# EAGLE design lightmagic (EAGLE 7.7.0)
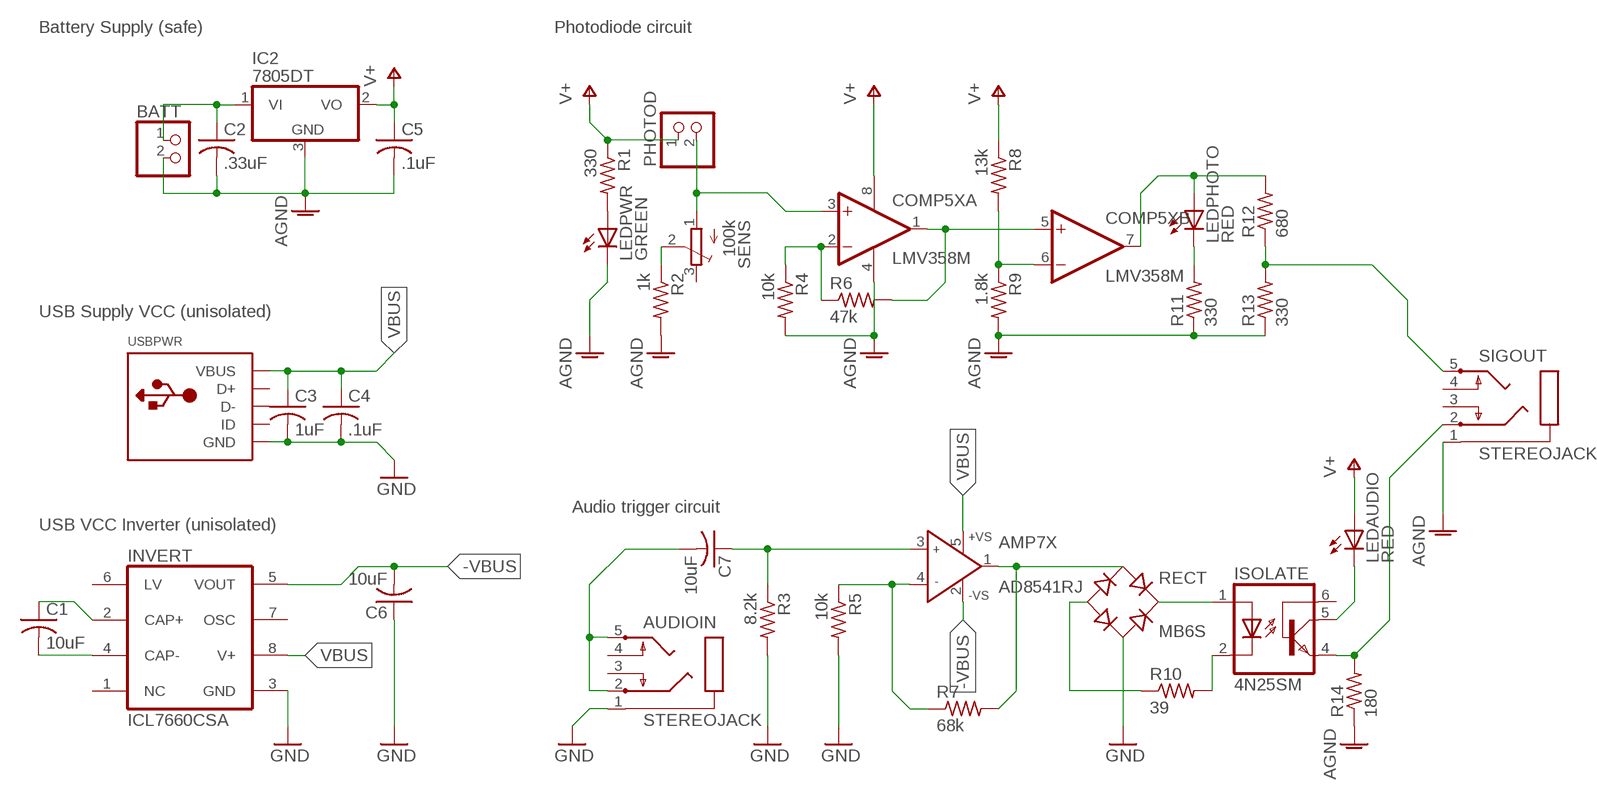
[diagram p0: schematic, sheet 1]

## Parts
AMP7X  AD8541RJ  [SOT23-5]
AUDIOIN  STEREOJACK  [STX3100]
BATT  PINHD-1X2  [1X02]
C1  10uF  C-USC0805  [C0805]
C2  .33uF  C-USC0805  [C0805]
C3  1uF  C-USC0805  [C0805]
C4  .1uF  C-USC0805  [C0805]
C5  .1uF  C-USC0805  [C0805]
C6  10uF  C-USC0805  [C0805]
C7  10uF  C-USC0805  [C0805]
COMP5X  LMV358M  [SO08]
IC2  7805DT  [TO252]
INVERT  ICL7660CSA  [SO08]
ISOLATE  4N25SM  [DIL6-SMD]
LEDAUDIO  RED  LEDCHIP-LED0805  [CHIP-LED0805]
LEDPHOTO  RED  LEDCHIP-LED0805  [CHIP-LED0805]
LEDPWR  GREEN  LEDCHIP-LED0805  [CHIP-LED0805]
PHOTOD  PINHD-1X2  [1X02]
R1  330  R-US_R0805  [R0805]
R2  1k  R-US_R0805  [R0805]
R3  8.2k  R-US_R0805  [R0805]
R4  10k  R-US_R0805  [R0805]
R5  10k  R-US_R0805  [R0805]
R6  47k  R-US_R0805  [R0805]
R7  68k  R-US_R0805  [R0805]
R8  13k  R-US_R0805  [R0805]
R9  1.8k  R-US_R0805  [R0805]
R10  39  R-US_R0805  [R0805]
R11  330  R-US_R0805  [R0805]
R12  680  R-US_R0805  [R0805]
R13  330  R-US_R0805  [R0805]
R14  180  R-US_R0805  [R0805]
RECT  MB6S  [SOIC-4]
SENS  100k  TRIMPOTTC33X  [TC33X]
SIGOUT  STEREOJACK  [STX3100]
USBPWR  USBMINIB  [USB-MINIB]

## Nets
-VBUS: AMP7X.2(-VS) C6.2 INVERT.5(VOUT)
AGND: BATT.2 C2.2 C5.2 COMP5X.4(P:V-) IC2.3(GND) LEDPWR.C R2.2 R4.2 R9.2 R11.1 R13.1 R14.1 SIGOUT.1
GND: AUDIOIN.1 C3.2 C4.2 C6.1 INVERT.3(GND) R3.2 R5.2 RECT.~2(AC2) USBPWR.GND
N$1: AMP7X.4(IN-) R5.1 R7.1
N$2: C1.1 INVERT.2(CAP+)
N$3: C1.2 INVERT.4(CAP-)
N$4: AUDIOIN.2 AUDIOIN.5 C7.2
N$5: AMP7X.3(IN+) C7.1 R3.1
N$6: AMP7X.1(OUT) R7.2 RECT.~1(AC1)
N$7: ISOLATE.1(A) RECT.+
N$8: ISOLATE.2(C) R10.2
N$9: R10.1 RECT.-
N$10: BATT.1 C2.1 IC2.1(VI)
N$11: R2.1 SENS.2(S)
N$12: LEDPWR.A R1.2
N$13: COMP5X.3(A:+IN) PHOTOD.2 SENS.1(A)
N$14: COMP5X.2(A:-IN) R4.1 R6.1
N$15: COMP5X.1(A:OUT) COMP5X.5(B:+IN) R6.2
N$16: COMP5X.6(B:-IN) R8.2 R9.1
N$17: ISOLATE.4(EMI) R14.2 SIGOUT.2
N$18: ISOLATE.5(COL) LEDAUDIO.C
N$19: LEDPHOTO.C R11.2
N$20: R12.1 R13.2 SIGOUT.5
N$21: COMP5X.7(B:OUT) LEDPHOTO.A R12.2
V+: C5.1 COMP5X.8(P:V+) IC2.2(VO) LEDAUDIO.A PHOTOD.1 R1.1 R8.1
VBUS: AMP7X.5(+VS) C3.1 C4.1 INVERT.8(V+) USBPWR.VBUS
Unconnected: AUDIOIN.3 AUDIOIN.4 INVERT.1(NC) INVERT.6(LV) INVERT.7(OSC) ISOLATE.6(BAS) SENS.3(E) SIGOUT.3 SIGOUT.4 USBPWR.D+ USBPWR.D- USBPWR.ID

## Notes on the sheet
- Battery Supply (safe) | Photodiode circuit
- USB Supply VCC (unisolated)
- Audio trigger circuit
- USB VCC Inverter (unisolated)

## Library data of the parts
AMP7X = analog-devices:AD8541: General-Purpose CMOS Rail-to-Rail Amplifiers Source: http://www.analog.com/static/imported-files/data_sheets/AD8541_8542_8544.pdf; MPN: AD8541ARTZ-R2; OC_FARNELL: 1464963; OC_NEWARK: 28X4209
AUDIOIN SIGOUT = adafruit:STEREOJACK: MIC/HEADPHONE JACK Stereo jack with two switches. Kycon STX3100, CUI SJ1-3555NG and/or 4UCon 05544; MF: SWITCHCRAFT; MPN: 35RAPC4BHN2; OC_NEWARK: 96F9607
BATT PHOTOD = pinhead:PINHD-1X2: PIN HEADER; MF: TYCO ELECTRONICS; MPN: 640456-2; OC_NEWARK: 90F4250
C1 C6 C7 = adafruit:C-US: CAPACITOR, American symbol; MPN: GRT21BR61E106KE13L; OC_NEWARK: 01AC8983
C2 = adafruit:C-US: CAPACITOR, American symbol; MPN: MC0805B334K500CT; OC_NEWARK: 06X6218
C3 = adafruit:C-US: CAPACITOR, American symbol; MPN: C0805X104K3RAC3316; OC_NEWARK: 01AC1593
C4 C5 = adafruit:C-US: CAPACITOR, American symbol; MPN: 0805YC104KAT2A; OC_NEWARK: 05AC9650
COMP5X = linear:LMV358?*: Dual General Purpose, Low Voltage, Rail-to-Rail Output Operational Amplifiers Source: http://www.national.com/mpf/LM/LMV321.html http://www.national.com/dt/lmv_qual.pdf; MPN: LMV358M; OC_NEWARK: 97K3153
IC2 = linear:78*: Positive VOLTAGE REGULATOR Source: http://cache.national.com/ds/LM/LM78L05.pdf http://www.fairchildsemi.com/ds/LM/LM7805.pdf; MF: ON SEMICONDUCTOR; MPN: MC7805CDTG; OC_NEWARK: 71J5739
INVERT = maxim:ICL7660CSA: VOLTAGE CONVERTER; MF: NATIONAL SEMICONDUCTOR; MPN: LMC7660IM/NOPB; OC_FARNELL: 9724710; OC_NEWARK: 41K2738
ISOLATE = optocoupler:4N*?M: General Purpose 6-Pin Phototransistor Optocouplers Source: http://www.fairchildsemi.com/ds/4N/4N35-M.pdf; MPN: 4N25-300E; OC_FARNELL: 1021152; OC_NEWARK: 13M5766
LEDAUDIO LEDPHOTO LEDPWR = adafruit:LED: LED OSRAM: - CHIPLED LG R971, LG N971, LY N971, LG Q971, LY Q971, LO R971, LY R971 LH N974, LH R974 LS Q976, LO Q976, LY Q976 LO Q996 - Hyper CHIPLED LW Q18S LB Q993, LB Q99A, LB R99A - SideLED LS A670, LO A670, LY A670, LG A670, LP A670 LB A673, LV A673, LT A673, LW A673 LH A674 LY A675 LS A676, LA A676, LO A676, LY A676, LW A676 LS A679, LY A679, LG A679 - Hyper Micro SIDELED® LS Y876, LA Y876, LO Y876, LY Y876 LT Y87S - SmartLED LW L88C, LW L88S LB L89C, LB L89S, LG L890 LS L89K, LO L89K, LY L89K LS L896, LA L896, LO L896, LY L896 - TOPLED LS T670, LO T670, LY T670, LG T670, LP T670 LSG T670, LSP T670, LSY T670, LOP T670, LYG T670 LG T671, LOG T671, LSG T671 LB T673, LV T673, LT T673, LW T673 LH T674 LS T676, LA T676, LO T676, LY T676, LB T676, LH T676, LSB T676, LW T676 LB T67C, LV T67C, LT T67C, LS T67K, LO T67K, LY T67K, LW E67C LS E67B, LA E67B, LO E67B, LY E67B, LB E67C, LV E67C, LT E67C LW T67C LS T679, LY T679, LG T679 LS T770, LO T770, LY T770, LG T770, LP T770 LB T773, LV T773, LT T773, LW T773 LH T774 LS E675, LA E675, LY E675, LS T675 LS T776, LA T776, LO T776, LY T776, LB T776 LHGB T686 LT T68C, LB T68C - Hyper Mini TOPLED® LB M676 - Mini TOPLED Santana® LG M470 LS M47K, LO M47K, LY M47K Source: http://www.osram.convergy.de/; MPN: QTLP630C7TR; OC_NEWARK: 01AC7976
R1 R11 R13 = adafruit:R-US_: RESISTOR, American symbol; MPN: ERJ-6ENF3300V; OC_NEWARK: 90W3413
R2 = adafruit:R-US_: RESISTOR, American symbol; MPN: ERJ-6ENF12R0V; OC_NEWARK: 64R5373
R3 = adafruit:R-US_: RESISTOR, American symbol; MF: Multicomp Passives; MPN: MC01W080518K2; OC_NEWARK: 58K4911
R4 R5 = adafruit:R-US_: RESISTOR, American symbol; MF: VISHAY/DALE; MPN: CRCW080510K0FKTA; OC_NEWARK: 05F1511
R6 = adafruit:R-US_: RESISTOR, American symbol; MF: VISHAY/DALE; MPN: CRCW080547K0FKEA; OC_NEWARK: 42K4553
R7 = adafruit:R-US_: RESISTOR, American symbol; MF: VISHAY/DALE; MPN: CRCW080568K0FKEA; OC_NEWARK: 53K0428
R8 = adafruit:R-US_: RESISTOR, American symbol; MF: VISHAY/DALE; MPN: CRCW080513K0FKEA; OC_NEWARK: 42K4278
R9 = adafruit:R-US_: RESISTOR, American symbol; MF: VISHAY/DALE; MPN: CRCW08051K80FKEA; OC_NEWARK: 42K4228
R10 = adafruit:R-US_: RESISTOR, American symbol; MPN: ERJ-6GEYJ390V; OC_NEWARK: 53W4957
R12 = adafruit:R-US_: RESISTOR, American symbol; MPN: ERA-6AEB681V; OC_NEWARK: 08N2184
R14 = adafruit:R-US_: RESISTOR, American symbol; MF: VISHAY/DALE; MPN: CRCW0805180RJNEA; OC_NEWARK: 01H7775
RECT = rectifier:MB*S: Bridge Rectifier Source: http://www.fairchildsemi.com/ds/MB/MB6S.pdf; MF: FAIRCHILD SEMICONDUCTOR; MPN: MB6S; OC_NEWARK: 58K1814
SENS = adafruit:TRIMPOT: SMT trimmer potentiometer part number TC33X http://www.ladyada.net/library/eagle; MPN: CRCW0805100KJNEA; OC_NEWARK: 04M8142
USBPWR = adafruit:USB: USB Connectors USBMINIB - Surface Mount Female Mini-B USB Connector 4UConnector: 06564 By microbuilder.eu Thru-hole RA Female Mini-B USB Connector 4UConnector: 18732 By ladyada.net; MPN: 1734035-1; OC_NEWARK: 16M2760

## Board
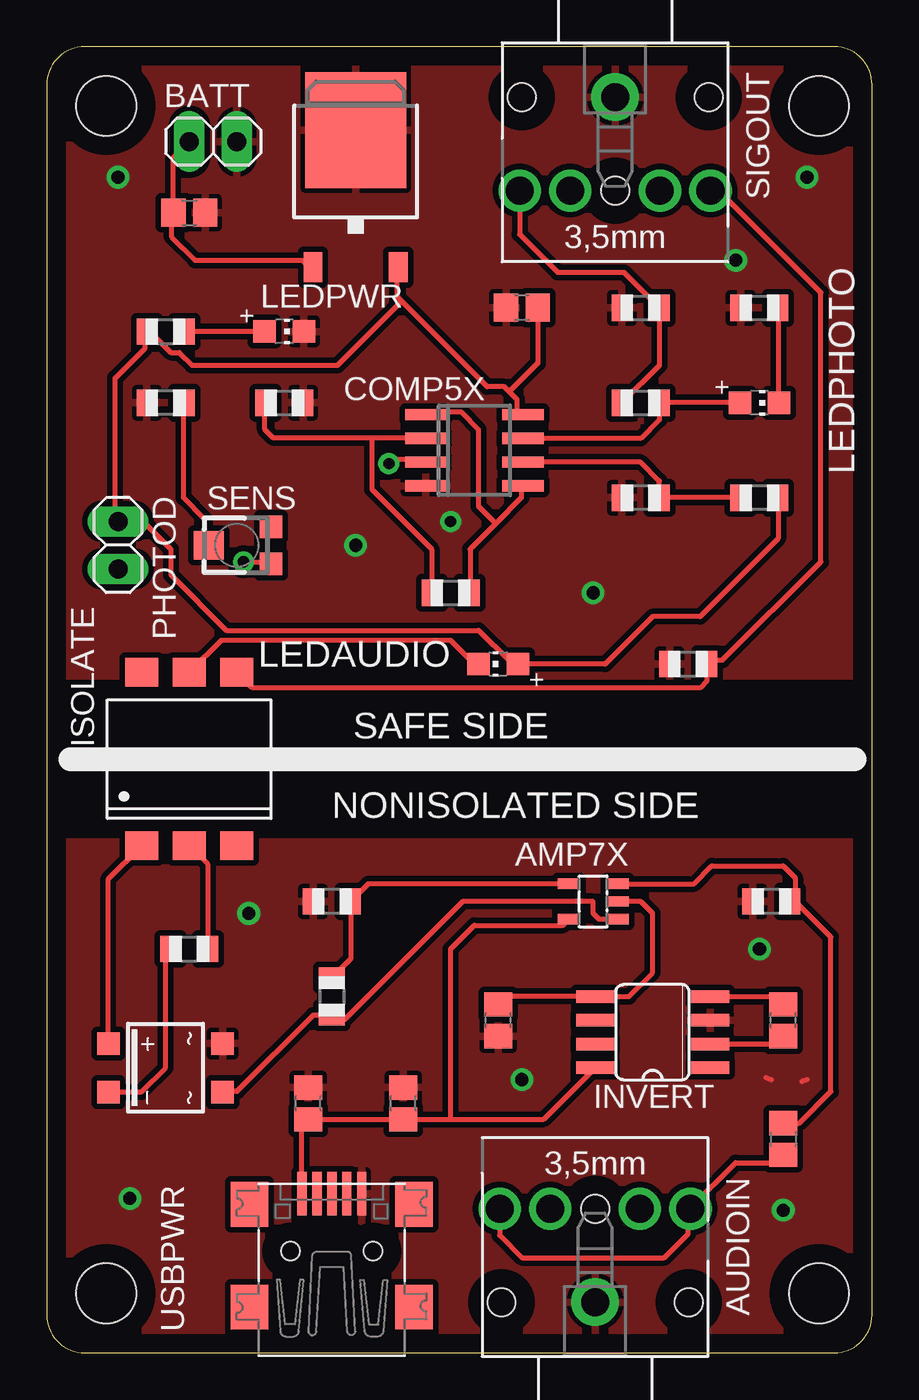
[diagram p1: board, top side]
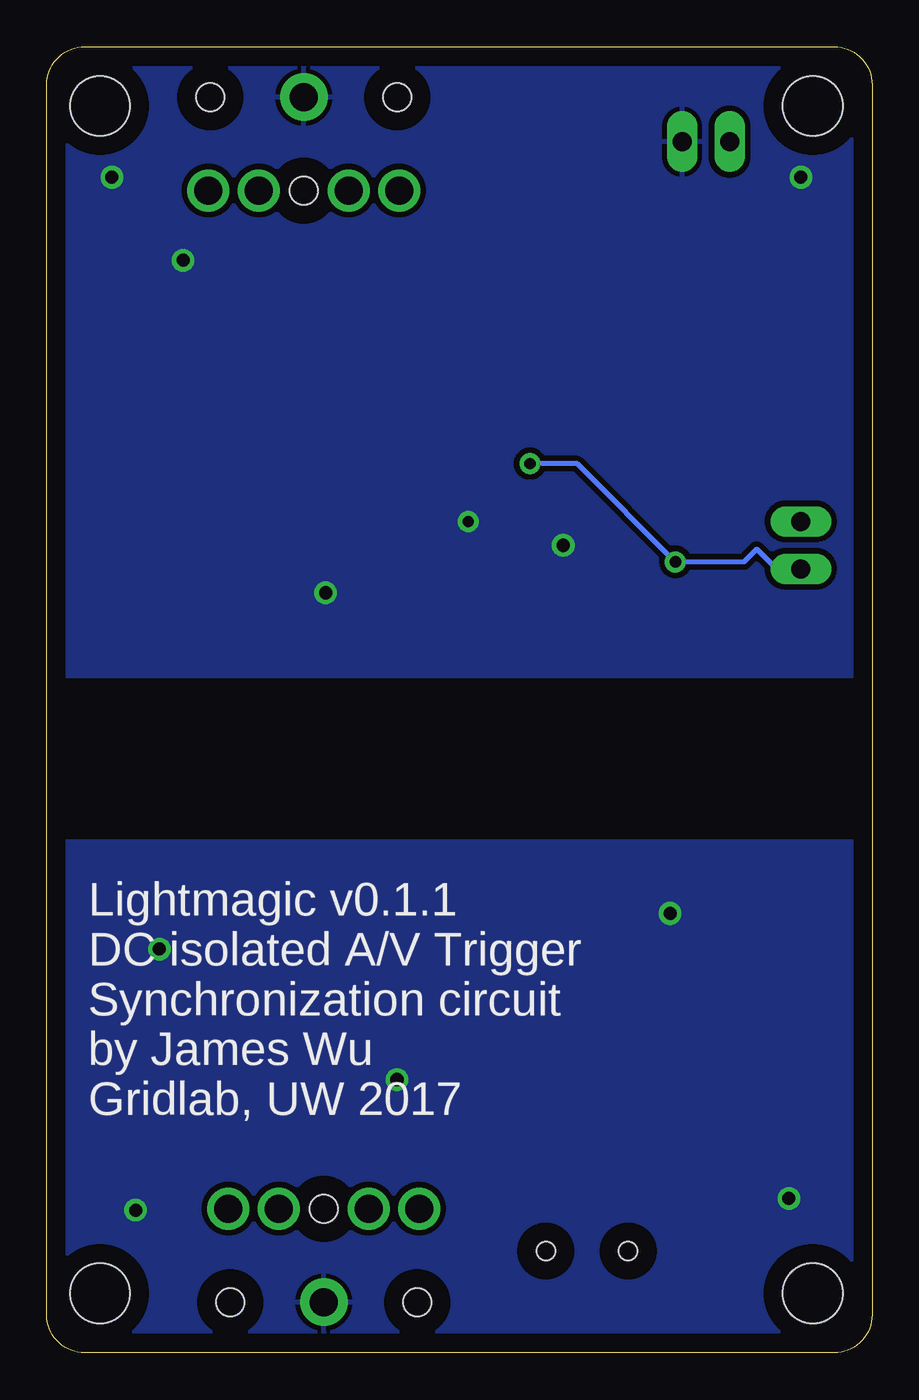
[diagram p2: board, bottom side, seen from below]

Size 44.12 x 69.84 mm. Coordinates in mm from the lower left corner, seen from the top.
Outline: 0,67.81 0,2.03 arc90 2.03,0 42.09,0 arc90 44.12,2.03 44.12,67.81 arc90 42.09,69.84 2.03,69.84 arc90 0,67.81
Copper layers (1*16): Top 0.035mm / dielectric 1.5mm / Bottom 0.035mm
Design rules "default *": minimum track width 10mil, minimum drill 24mil, track to track 8mil, track to pad 8mil, pad to pad 8mil, via to via 8mil, smd to smd 8mil, copper to edge 40mil, drill to drill 8mil, minimum pad ring 12mil, minimum via ring 10mil, stop-mask expansion 4mil, vias tented up to drill 0mil, thermal gap 10mil
Holes 3.2 mm at 41.27,3.17 3.17,3.17 3.17,66.67 41.27,66.67

### Footprints (pad centres in the part's own frame; a part is rotated, then mirrored left to right if it is on the bottom)
SOT23-5 = smd 0.55 x 1.2: 1 -0.95,-1.3; 2 0,-1.3; 3 0.95,-1.3; 4 0.95,1.3; 5 -0.95,1.3
STX3100 = drill 1.5 pad 2.54: 1 2.7,-0.1 | drill 1.5: 2 7.7,5; 3 7.7,2.3; 4 7.7,-2.5; 5 7.7,-5.2 | hole 1.5: 2.7,4.9; 2.7,-5.1; 7.7,-0.1
1X02 = drill 1.016 long: 1 -1.27,0; 2 1.27,0
C0805 = smd 1.3 x 1.5: 1 -0.85,0; 2 0.85,0
SO08 = smd 0.6 x 2.2: 1 -1.905,-2.6; 2 -0.635,-2.6; 3 0.635,-2.6; 4 1.905,-2.6; 5 1.905,2.6; 6 0.635,2.6; 7 -0.635,2.6; 8 -1.905,2.6
TO252 = smd 1 x 1.6: 1 -2.28,-4.8; 2 2.28,-4.8 | smd 5.4 x 6.2: 3 0,2.5
SO08' = smd 0.66 x 2.032: 1 -1.905,-3.073; 2 -0.635,-3.073; 3 0.635,-3.073; 4 1.905,-3.073; 5 1.905,3.073; 6 0.635,3.073; 7 -0.635,3.073; 8 -1.905,3.073
DIL6-SMD = smd 1.78 x 1.52: 1 -2.54,-4.645; 2 0,-4.645; 3 2.54,-4.645; 4 2.54,4.645; 5 0,4.645; 6 -2.54,4.645
CHIP-LED0805 = smd 1.2 x 1.2: A 0,-1.05; C 0,1.05
R0805 = smd 1.1 x 1.4: 1 -1,0; 2 1,0
SOIC-4 = smd 1.2 x 1.2: + 1.3,3.05; - -1.3,3.05; ~1 -1.3,-3.05; ~2 1.3,-3.05
TC33X = smd 1.2 x 1.2: 1 -1,-1.825; 3 1,-1.825 | smd 1.5 x 1.6: 2 0,1.5
USB-MINIB = smd 0.5 x 2.308: D+ 0,4.064; D- -0.8,4.064; GND 1.6,4.064; ID 0.8,4.064; VBUS -1.6,4.064 | smd 2 x 2.4: GND1 -4.4,-2; GND2 -4.4,3.5; GND3 4.4,3.5; GND4 4.4,-2 | hole 1: -2.2,1; 2.2,1

### Placement (x,y rotation side)
AMP7X  29.21,24.13 90 top
AUDIOIN  29.21,0 90 top
BATT  8.89,64.77 0 top
C1  39.37,17.78 90 top
C2  7.62,60.96 0 top
C3  19.05,13.34 90 top
C4  13.97,13.34 90 top
C5  25.4,55.88 180 top
C6  24.13,17.78 90 top
C7  39.37,11.43 270 top
COMP5X  22.86,48.26 270 top
IC2  16.51,62.87 0 top
INVERT  ICL7660CSA  [SO08']  32.38,17.14 90 top
ISOLATE  7.62,31.75 0 top
LEDAUDIO  24.13,36.83 90 top
LEDPHOTO  38.1,50.8 270 top
LEDPWR  12.7,54.61 270 top
PHOTOD  3.81,43.18 270 top
R1  6.35,54.61 0 top
R2  6.35,50.8 180 top
R3  38.73,24.13 180 top
R4  12.7,50.8 0 top
R5  15.24,24.13 180 top
R6  21.59,40.64 0 top
R7  15.24,19.05 270 top
R8  38.1,45.72 180 top
R9  31.75,45.72 180 top
R10  7.62,21.59 0 top
R11  38.1,55.88 0 top
R12  31.75,50.8 0 top
R13  31.75,55.88 0 top
R14  34.29,36.83 0 top
RECT  6.35,15.24 90 top
SENS  10.16,43.18 90 top
SIGOUT  30.48,69.85 270 top
USBPWR  15.24,4.45 0 top

### Tracks (layer width: path | path; a pad name or v marks a point on that pad's centre or on a via)
-VBUS
  Top 0.254: C6.2 24.55,19.05 INVERT.5 31.11,19.05 32.38,20.32 32.38,23.5 31.75,24.13 AMP7X.2
AGND  (via drill 0.61, 0.7)
  other vias: 40.64,62.87 3.81,62.87 36.83,58.42 21.59,44.45 16.51,43.18 29.21,40.64
  pour Top (isolate 0.305): -1.27,71.12 45.72,71.12 45.72,36.2 -1.27,36.2
  pour Bottom (isolate 0.305): 0,69.85 0,36.2 44.45,36.2 44.45,69.85
GND  (via drill 0.7)
  Top 0.254: 40.64,14.61 40.38,14.5 | 38.73,14.61 38.46,14.7
  other vias: 10.79,23.5 4.45,8.26 25.4,14.61 38.1,21.59 39.37,7.62
  pour Top (isolate 0.305): -1.27,27.3 45.72,27.3 45.72,0 -1.27,0
  pour Bottom (isolate 0.305): -1.27,27.3 45.72,27.3 45.72,-1.27 -1.27,-1.27
N$1
  Top 0.254: AMP7X.4 17.19,25.08 R5.1 16.24,21.05 R7.1
N$2
  Top 0.254: INVERT.2 38.95,16.51 C1.1
N$3
  Top 0.254: INVERT.4 38.95,19.05 C1.2
N$4
  Top 0.254: AUDIOIN.2 24.21,6.27 25.4,5.08 33.02,5.08 34.29,6.35 34.29,7.58 AUDIOIN.5 34.41,7.74 36.83,10.16 38.95,10.16 C7.2
N$5
  Top 0.254: C7.1 40.22,12.28 41.91,13.97 41.91,22.23 40.01,24.13 R3.1 40.01,24.4 40.01,25.4 39.37,26.04 35.56,26.04 34.6,25.08 AMP7X.3
N$6
  Top 0.254: AMP7X.1 29.52,23.18 29.21,23.5 29.21,24.13 22.23,24.13 15.88,17.78 15.51,17.78 R7.2 14.24,18.05 10.16,13.97 9.43,13.97 RECT.~1
N$7
  Top 0.254: RECT.+ 3.3,25.32 ISOLATE.1
N$8
  Top 0.254: R10.2 8.62,26.11 ISOLATE.2
N$9
  Top 0.254: RECT.- 5.05,13.94 6.35,15.24 6.35,21.32 R10.1
N$10
  Top 0.254: BATT.1 6.77,63.92 C2.1 6.67,60.96 6.67,59.69 7.94,58.42 13.65,58.42 13.97,58.1 IC2.1
N$11
  Top 0.254: R2.1 7.32,50.75 7.32,45.72 8.46,44.58 8.46,43.2 SENS.2
N$12
  Top 0.254: LEDPWR.A 11.43,54.63 7.54,54.63 R1.2
N$13  (via drill 0.61)
  Top 0.254: v10.52,42.29 11.89,42.29 SENS.1 | v18.29,47.55 18.52,47.55 18.75,47.78 20.12,47.78 COMP5X.3
  Bottom 0.254: PHOTOD.2 3.89,42.06 5.26,42.06 6.17,42.98 6.86,42.29 v10.52,42.29 15.77,47.55 v18.29,47.55
N$14
  Top 0.254: 17.37,48.92 20.12,48.92 COMP5X.2 | 17.37,48.92 12.12,48.92 11.66,49.38 11.66,50.75 R4.1 | 17.37,48.92 17.37,46.18 20.57,42.98 20.57,40.69 R6.1
N$15
  Top 0.254: 24,44.35 25.38,45.72 25.38,46.18 COMP5X.5 | 24,44.35 22.63,42.98 22.63,40.69 R6.2 | 24,44.35 23.09,45.26 23.09,49.38 22.17,50.29 20.34,50.29 COMP5X.1
N$16
  Top 0.254: R8.2 R9.1 32.75,46.62 31.75,47.62 COMP5X.6
N$17
  Top 0.254: SIGOUT.2 35.66,61.95 36.12,61.95 41.38,56.69 41.38,42.29 36.12,37.03 35.43,37.03 R14.2 35.29,35.92 34.92,35.56 10.99,35.56 ISOLATE.4
N$18
  Top 0.254: LEDAUDIO.C 22.86,36.83 21.59,38.1 9.32,38.1 ISOLATE.5
N$19
  Top 0.254: LEDPHOTO.C 39.09,50.98 39.09,55.78 R11.2
N$20
  Top 0.254: SIGOUT.5 25.28,59.81 27.3,57.78 30.84,57.78 R13.2 32.75,52.8 R12.1
N$21
  Top 0.254: LEDPHOTO.A R12.2 32.75,49.9 31.75,48.9 COMP5X.7
V+
  Top 0.254: 18.97,56.24 23.55,51.66 24.46,51.66 24.73,51.4 | 18.97,56.24 18.75,56.46 18.75,58.06 IC2.2 | 24.73,51.4 25.15,50.98 25.15,50.29 25.38,50.06 COMP5X.8 | 18.97,56.24 15.54,52.81 7.77,52.81 7.09,53.49 6.63,53.49 5.49,54.63 R1.1 5.26,54.41 5.26,53.72 3.66,52.12 3.66,44.58 PHOTOD.1 3.89,44.35 5.26,44.35 6.63,42.98 6.63,41.6 9.6,38.63 23.09,38.63 24.69,37.03 25.15,37.03 LEDAUDIO.A 29.84,36.83 32.38,39.37 34.92,39.37 39.1,43.55 R8.1 | C5.1 26.25,52.92 24.73,51.4
VBUS
  Top 0.254: USBPWR.VBUS 13.64,12.15 C4.1 C3.1 21.59,12.48 | 21.59,12.48 26.56,12.48 28.94,14.87 | 28.94,14.87 INVERT.8 | 21.59,12.48 21.59,21.59 22.86,22.86 27.59,22.86 AMP7X.5 | 28.57,15.24 28.94,14.87

### Text on the board
tNames: SAFE SIDE / / NONISOLATED SIDE
bNames: Lightmagic v0.1.1 / DC isolated A/V Trigger / Synchronization circuit / by James Wu / Gridlab, UW 2017